# Altium schematic sheet DINOBUS.SchDoc: document title
size C; ApprovedBy: Vincent Himpe; CheckedBy: Vincent Himpe; Author: Vincent Himpe; CompanyName: STMicroelectronics; DrawnBy: Vincent Himpe; Organization: BCD Application; Address1: 2525 Augustine Drive; Address2: Santa Clara 95054 CA; Address3: USA; Revision: A; Project: Project title; DrawnByContact: +1 (408) 451 8116; DrawnByEmail: vincent.himpe@st.com
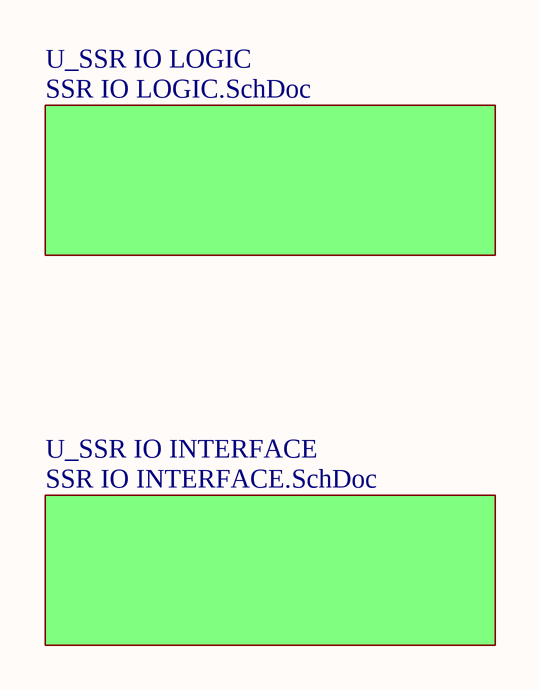
[diagram p0: DINOBUS.SchDoc]

## Sub-sheets
U_SSR IO INTERFACE = SSR IO INTERFACE.SchDoc: no entries
U_SSR IO LOGIC = SSR IO LOGIC.SchDoc: no entries

## Notes on the sheet
- PROJECT
- STMicroelectronics
- Last Modified
- Sheet
- of
- Document
- Revision
- Drawn By
- Information in this document is the intellectual property of STMicroelectronics.Disclosure outside of STMicroelectronics is prohibited without prior written approval. Contents may be subject to Patent or Patent application.
- 2525 Augustine Drive
- Santa Clara 95054 CA
- USA